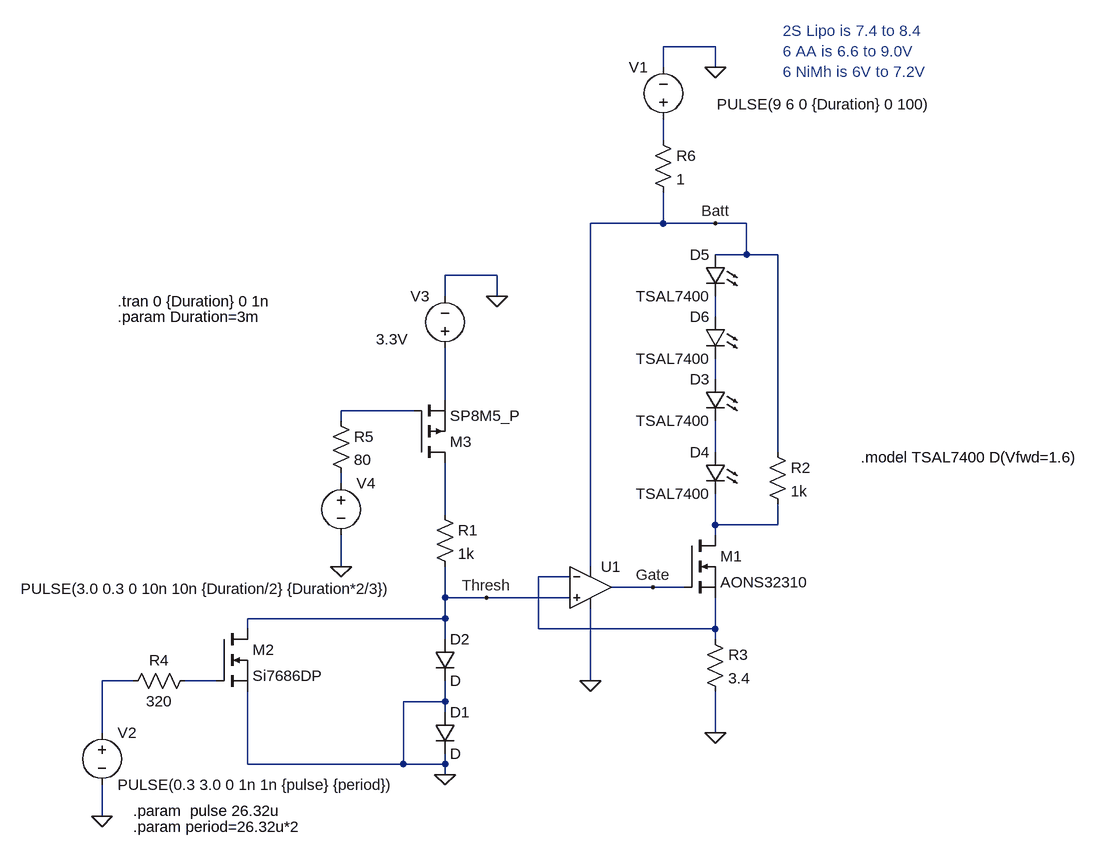
[diagram p0: schematic LanternEmitter.asc]
LanternEmitter.asc, the LTspice schematic file:
Version 4
SHEET 1 1008 680
WIRE 304 -656 224 -656
WIRE 224 -624 224 -656
WIRE 304 -624 304 -656
WIRE 224 -512 224 -544
WIRE 224 -384 224 -432
WIRE 224 -384 112 -384
WIRE 304 -384 224 -384
WIRE 352 -384 304 -384
WIRE 352 -336 352 -384
WIRE 352 -336 304 -336
WIRE 400 -336 352 -336
WIRE -32 -304 -112 -304
WIRE -112 -272 -112 -304
WIRE -32 -272 -32 -304
WIRE 304 -240 304 -272
WIRE 304 -144 304 -176
WIRE -112 -112 -112 -192
WIRE -160 -96 -272 -96
WIRE -272 -80 -272 -96
WIRE 304 -32 304 -80
WIRE 400 -32 400 -336
WIRE -272 16 -272 0
WIRE -112 64 -112 -16
WIRE 304 80 304 32
WIRE 400 80 400 48
WIRE 400 80 304 80
WIRE 304 96 304 80
WIRE -272 144 -272 96
WIRE 112 144 112 -384
WIRE 80 160 32 160
WIRE 208 176 144 176
WIRE 256 176 208 176
WIRE -112 192 -112 144
WIRE -48 192 -112 192
WIRE 80 192 -48 192
WIRE -112 224 -112 192
WIRE -112 224 -416 224
WIRE -416 240 -416 224
WIRE 32 240 32 160
WIRE 304 240 304 192
WIRE 304 240 32 240
WIRE -112 256 -112 224
WIRE 304 256 304 240
WIRE -592 320 -640 320
WIRE -464 320 -512 320
WIRE 112 320 112 208
WIRE -112 352 -112 320
WIRE -112 352 -176 352
WIRE -112 368 -112 352
WIRE -640 400 -640 320
WIRE 304 400 304 336
WIRE -416 448 -416 336
WIRE -176 448 -176 352
WIRE -176 448 -416 448
WIRE -112 448 -112 432
WIRE -112 448 -176 448
WIRE -112 464 -112 448
WIRE -640 528 -640 480
FLAG 112 320 0
FLAG -112 464 0
FLAG 304 -624 0
FLAG 304 400 0
FLAG 304 -384 Batt
FLAG 208 176 Gate
FLAG -48 192 Thresh
FLAG -640 528 0
FLAG -32 -272 0
FLAG -272 144 0
SYMBOL Opamps\\UniversalOpamp2 112 176 R0
SYMATTR InstName U1
SYMATTR Value2 Avol=1Meg GBW=10Meg Slew=1Meg
SYMBOL nmos 256 96 R0
SYMATTR InstName M1
SYMATTR Value AONS32310
SYMBOL res -128 48 R0
SYMATTR InstName R1
SYMATTR Value 1k
SYMBOL voltage 224 -528 R180
WINDOW 0 24 96 Left 2
WINDOW 3 -413 39 Left 2
WINDOW 123 0 0 Left 0
WINDOW 39 0 0 Left 0
SYMATTR InstName V1
SYMATTR Value PULSE(9 6 0 {Duration} 0 100)
SYMBOL res 288 240 R0
SYMATTR InstName R3
SYMATTR Value 3.4
SYMBOL res 384 -48 R0
SYMATTR InstName R2
SYMATTR Value 1k
SYMBOL voltage -640 384 R0
WINDOW 123 0 0 Left 0
WINDOW 39 0 0 Left 0
SYMATTR InstName V2
SYMATTR Value PULSE(0.3 3.0 0 1n 1n {pulse} {period})
SYMBOL pmos -160 -16 M180
SYMATTR InstName M3
SYMATTR Value SP8M5_P
SYMBOL voltage -112 -176 R180
WINDOW 0 24 96 Left 2
WINDOW 3 57 30 Left 2
WINDOW 123 0 0 Left 0
WINDOW 39 0 0 Left 0
SYMATTR InstName V3
SYMATTR Value 3.3V
SYMBOL voltage -272 0 R0
WINDOW 3 -493 178 Left 2
WINDOW 123 0 0 Left 0
WINDOW 39 0 0 Left 0
SYMATTR Value PULSE(3.0 0.3 0 10n 10n {Duration/2} {Duration*2/3})
SYMATTR InstName V4
SYMBOL nmos -464 240 R0
SYMATTR InstName M2
SYMATTR Value Si7686DP
SYMBOL res -496 304 R90
WINDOW 0 0 56 VBottom 2
WINDOW 3 32 56 VTop 2
SYMATTR InstName R4
SYMATTR Value 320
SYMBOL res -288 -96 R0
SYMATTR InstName R5
SYMATTR Value 80
SYMBOL diode -128 256 R0
SYMATTR InstName D2
SYMBOL LED 320 -32 M0
SYMATTR InstName D4
SYMATTR Value TSAL7400
SYMBOL diode -128 368 R0
SYMATTR InstName D1
SYMBOL res 208 -528 R0
SYMATTR InstName R6
SYMATTR Value 1
SYMBOL LED 320 -144 M0
SYMATTR InstName D3
SYMATTR Value TSAL7400
SYMBOL LED 320 -336 M0
SYMATTR InstName D5
SYMATTR Value TSAL7400
SYMBOL LED 320 -240 M0
SYMATTR InstName D6
SYMATTR Value TSAL7400
TEXT -616 -264 Left 2 !.tran 0 {Duration} 0 1n
TEXT -592 520 Left 2 !.param  pulse 26.32u
TEXT -592 544 Left 2 !.param period=26.32u*2
TEXT 528 -24 Left 2 !.model TSAL7400 D(Vfwd=1.6)
TEXT 408 -680 Left 2 ;2S Lipo is 7.4 to 8.4\n6 AA is 6.6 to 9.0V\n6 NiMh is 6V to 7.2V
TEXT -616 -240 Left 2 !.param Duration=3m

The netlist it stands for:
* LanternEmitter.asc
XU1 Thresh N010 Batt 0 Gate level.2 Avol=1Meg GBW=10Meg Slew=1Meg ilimit=25m rail=0 Vos=0 phimargin=45 en=0 enk=0 in=0 ink=0 Rin=500Meg  ; pins IN+ IN- V+ V- OUT
M1 N009 Gate N010 N010 AONS32310
R1 N008 Thresh 1k
V1 N001 0 PULSE(9 6 0 {Duration} 0 100)
R3 N010 0 3.4
R2 Batt N009 1k
V2 N011 0 PULSE(0.3 3.0 0 1n 1n {pulse} {period})
M3 N008 N005 N004 N004 SP8M5_P
V3 N004 0 3.3V
V4 N007 0 PULSE(3.0 0.3 0 10n 10n {Duration/2} {Duration*2/3})
M2 Thresh N012 0 0 Si7686DP
R4 N012 N011 320
R5 N005 N007 80
D2 Thresh 0 D
D4 N006 N009 TSAL7400
D1 0 0 D
R6 N001 Batt 1
D3 N003 N006 TSAL7400
D5 Batt N002 TSAL7400
D6 N002 N003 TSAL7400
.model D D
.lib standard.dio
.model NMOS NMOS
.model PMOS PMOS
.lib standard.mos
.tran 0 {Duration} 0 1n
.param  pulse 26.32u
.param period=26.32u*2
.model TSAL7400 D(Vfwd=1.6)
* 2S Lipo is 7.4 to 8.4
* 6 AA is 6.6 to 9.0V
* 6 NiMh is 6V to 7.2V
.param Duration=3m
.lib UniversalOpamps2.sub
.backanno
.end